# Altium project SmartMCU.PrjPcb
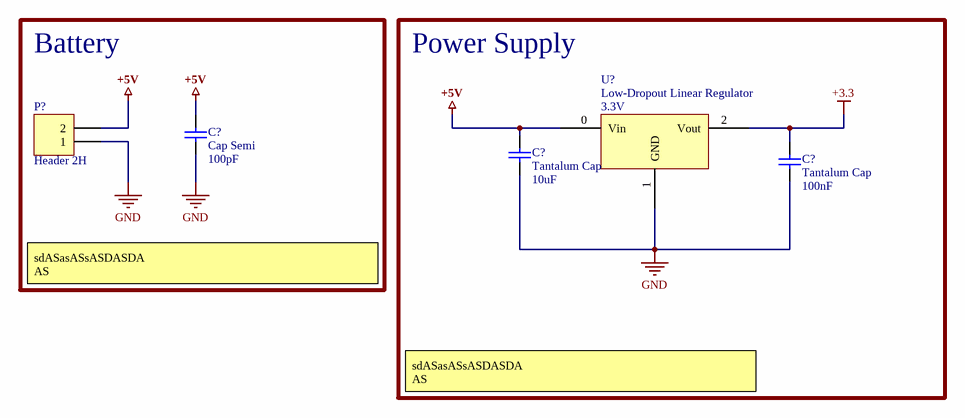
[diagram p0: main.SchDoc]
Designer: Ali S; Start Date: 2023
1 sheet, 5 parts. Net scope: global (net labels, ports and power ports of the same name join across sheets).

## Sheet main.SchDoc
size A3; Author: Ali Siamwala; SheetNumber: 1; SheetTotal: 1

### Parts
(Parts that share a designator on the sheet are numbered #1, #2 ... from top to bottom, then left to right.)
C?#1  Cap Semi  value 100pF  [C1206]
C?#2  Tantalum Cap  value 10uF  [C1206]
C?#3  Tantalum Cap  value 100nF  [C1206]
P?  Header 2H  [HDR1X2H]
U?  Low-Dropout Linear Regulator  OutputVoltage: 3.3V

### Blocks framed on the sheet
Battery: C?#1 P?
Power Supply: C?#2 C?#3 U?

### Nets
+3.3: C?#3.2 U?.2(Vout)
+5V: C?#1.2 C?#2.2 P?.2 U?.0(Vin)
GND: C?#1.1 C?#2.1 C?#3.1 P?.1 U?.1(GND)

### Notes on the sheet
- sdASasASsASDASDA
  AS
  SA
  SD
  AS
  DA
  SD
  ZXC
  ZXC
  ASD

### Library data of the parts
C?#1-C?#3 = Cap Semi: Capacitor (Semiconductor SIM Model); Published: 8-Jun-2000; LatestRevisionDate: 29-May-2009; LatestRevisionNote: IPC-7351 Footprint Added.; PackageReference: C1206; Publisher: Altium Limited; PackageDescription: Chip Capacitor
P? = Header 2H: Header, 2-Pin, Right Angle; Voltage: 9V; LatestRevisionDate: 17-Jul-2002; LatestRevisionNote: Re-released for DXP Platform.; Publisher: Altium Limited
U? = LM1117: The LM1117 is a low dropout voltage regulator with a / dropout of 1.2 V at 800 mA of load current. / The LM1117 is available in an adjustable version, / which can set the output voltage from 1.25 V to 13.8 V / with only two external resistors. In addition, the device / is available in five fixed voltages, 1.8 V, 2.5 V, 3.3 V, / and 5 V. / The LM1117 offers current limiting and thermal / shutdown. The circuit includes a Zener trimmed bandgap reference to assure output voltage accuracy to / within ±1%. / A minimum of 10-µF tantalum capacitor is required / at the output to improve the transient response and / stability.; ComponentLink1Description: Datasheet; ComponentLink1URL: https://www.ti.com/lit/ds/symlink/lm1117.pdf?ts=1678245632508&ref_url=https%253A%252F%252Fwww.google.lk%252F